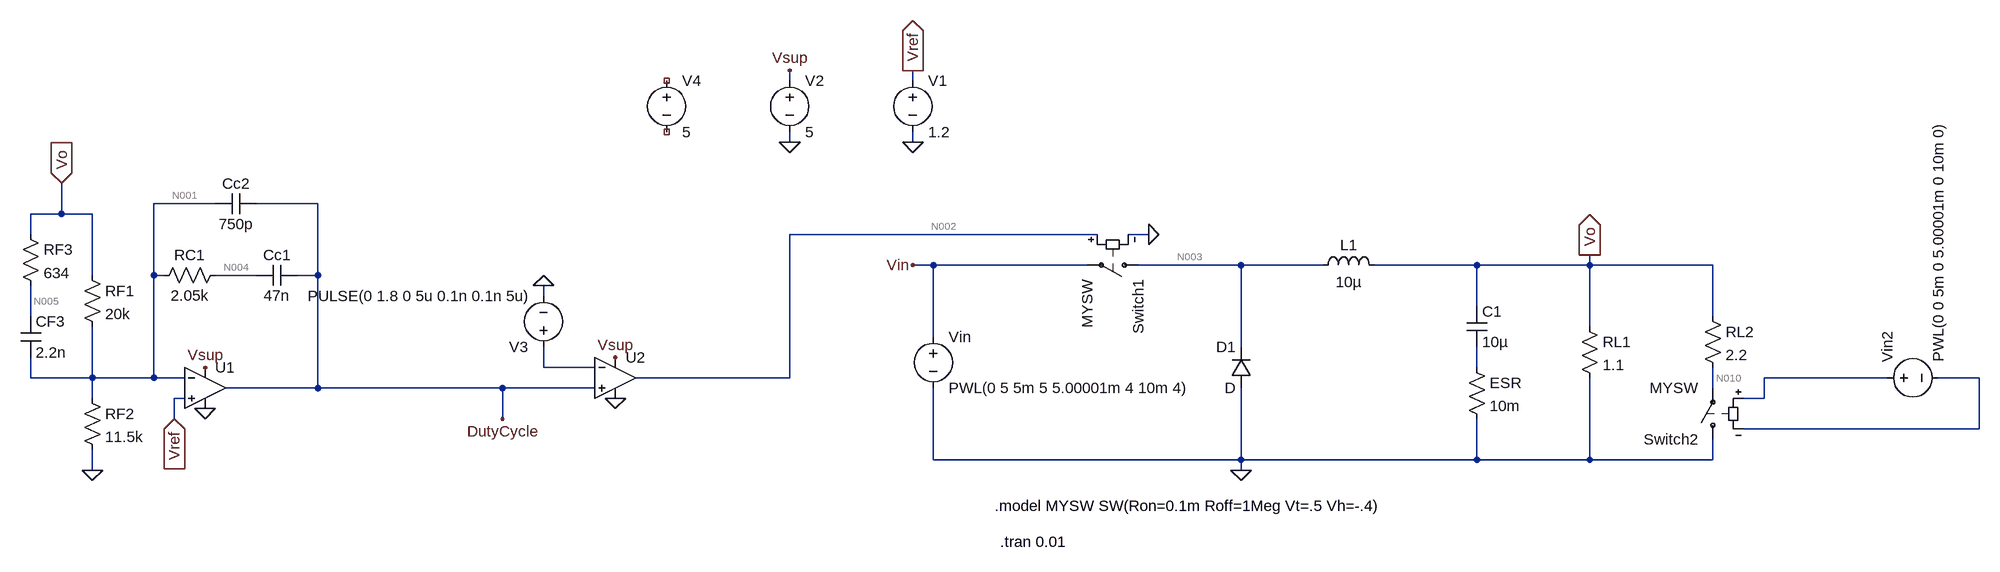
[diagram p0: schematic Buck_Controller_Modeling_20kHz.asc]
Buck_Controller_Modeling_20kHz.asc, the LTspice schematic file:
Version 4
SHEET 1 1812 680
WIRE -48 -272 -48 -288
WIRE 144 -272 144 -288
WIRE -48 -176 -48 -192
WIRE 144 -176 144 -192
WIRE -944 -80 -1040 -80
WIRE -784 -80 -880 -80
WIRE -1184 -64 -1184 -112
WIRE -1184 -64 -1232 -64
WIRE -1136 -64 -1184 -64
WIRE -1232 -32 -1232 -64
WIRE 432 -32 -48 -32
WIRE 512 -32 480 -32
WIRE 176 16 144 16
WIRE 416 16 176 16
WIRE 656 16 496 16
WIRE 784 16 656 16
WIRE 1024 16 864 16
WIRE 1200 16 1200 0
WIRE 1200 16 1024 16
WIRE 1392 16 1200 16
WIRE -1136 32 -1136 -64
WIRE -1040 32 -1040 -80
WIRE -1024 32 -1040 32
WIRE -880 32 -944 32
WIRE -784 32 -784 -80
WIRE -784 32 -816 32
WIRE -432 64 -432 48
WIRE 1024 80 1024 16
WIRE -1232 96 -1232 48
WIRE 1392 96 1392 16
WIRE 1200 112 1200 16
WIRE 176 128 176 16
WIRE 656 144 656 16
WIRE -432 176 -432 144
WIRE -352 176 -432 176
WIRE 1024 176 1024 144
WIRE -1232 192 -1232 160
WIRE -1136 192 -1136 112
WIRE -1136 192 -1232 192
WIRE -1040 192 -1040 32
WIRE -1040 192 -1136 192
WIRE -992 192 -1040 192
WIRE -48 192 -48 -32
WIRE -48 192 -288 192
WIRE 1664 192 1472 192
WIRE 1808 192 1744 192
WIRE -784 208 -784 32
WIRE -784 208 -928 208
WIRE -496 208 -784 208
WIRE -352 208 -496 208
WIRE 1392 208 1392 176
WIRE -1136 224 -1136 192
WIRE -992 224 -1008 224
WIRE 1472 224 1472 192
WIRE 1472 224 1440 224
WIRE -1008 256 -1008 224
WIRE -496 256 -496 208
WIRE 1808 272 1808 192
WIRE 1808 272 1440 272
WIRE 176 320 176 208
WIRE 656 320 656 208
WIRE 656 320 176 320
WIRE 1024 320 1024 256
WIRE 1024 320 656 320
WIRE 1200 320 1200 192
WIRE 1200 320 1024 320
WIRE 1392 320 1392 288
WIRE 1392 320 1200 320
WIRE -1136 336 -1136 304
WIRE 656 336 656 320
FLAG 656 336 0
FLAG 1200 0 Vo
IOPIN 1200 0 Out
FLAG 144 -176 0
FLAG 144 -288 Vref
IOPIN 144 -288 Out
FLAG -1136 336 0
FLAG -1008 256 Vref
IOPIN -1008 256 In
FLAG -48 -176 0
FLAG -48 -288 Vsup
FLAG -960 176 Vsup
FLAG -960 240 0
FLAG -432 48 0
FLAG -320 160 Vsup
FLAG -320 224 0
FLAG 512 -32 0
FLAG -1184 -112 Vo
IOPIN -1184 -112 In
FLAG -496 256 DutyCycle
FLAG 144 16 Vin
SYMBOL voltage 176 112 R0
WINDOW 123 0 0 Left 0
WINDOW 39 0 0 Left 0
SYMATTR InstName Vin
SYMATTR Value PWL(0 5 5m 5 5.00001m 4 10m 4)
SYMBOL sw 512 16 R90
SYMATTR InstName Switch1
SYMATTR Value MYSW
SYMBOL diode 672 208 R180
WINDOW 0 24 64 Left 2
WINDOW 3 24 0 Left 2
SYMATTR InstName D1
SYMBOL ind 768 32 R270
WINDOW 0 32 56 VTop 2
WINDOW 3 5 56 VBottom 2
SYMATTR InstName L1
SYMATTR Value 10µ
SYMBOL cap 1008 80 R0
SYMATTR InstName C1
SYMATTR Value 10µ
SYMBOL res 1008 160 R0
SYMATTR InstName ESR
SYMATTR Value 10m
SYMBOL res 1184 96 R0
SYMATTR InstName RL1
SYMATTR Value 1.1
SYMBOL Opamps\\UniversalOpamp2 -960 208 R0
SYMATTR InstName U1
SYMBOL voltage 144 -288 R0
SYMATTR InstName V1
SYMATTR Value 1.2
SYMBOL res -1248 -48 R0
SYMATTR InstName RF3
SYMATTR Value 634
SYMBOL res -1152 16 R0
SYMATTR InstName RF1
SYMATTR Value 20k
SYMBOL cap -1248 96 R0
SYMATTR InstName CF3
SYMATTR Value 2.2n
SYMBOL res -1152 208 R0
SYMATTR InstName RF2
SYMATTR Value 11.5k
SYMBOL res -928 16 R90
WINDOW 0 0 56 VBottom 2
WINDOW 3 32 56 VTop 2
SYMATTR InstName RC1
SYMATTR Value 2.05k
SYMBOL cap -816 16 R90
WINDOW 0 0 32 VBottom 2
WINDOW 3 32 32 VTop 2
SYMATTR InstName Cc1
SYMATTR Value 47n
SYMBOL cap -880 -96 R90
WINDOW 0 0 32 VBottom 2
WINDOW 3 32 32 VTop 2
SYMATTR InstName Cc2
SYMATTR Value 750p
SYMBOL voltage -48 -288 R0
WINDOW 123 0 0 Left 0
WINDOW 39 0 0 Left 0
SYMATTR InstName V2
SYMATTR Value 5
SYMBOL Opamps\\UniversalOpamp2 -320 192 R0
SYMATTR InstName U2
SYMBOL voltage -432 160 R180
WINDOW 123 0 0 Left 0
WINDOW 39 0 0 Left 0
SYMATTR InstName V3
SYMATTR Value PULSE(0 1.8 0 5u 0.1n 0.1n 5u)
SYMBOL sw 1392 304 R180
SYMATTR InstName Switch2
SYMATTR Value MYSW
SYMBOL res 1376 80 R0
SYMATTR InstName RL2
SYMATTR Value 2.2
SYMBOL voltage 1648 192 R270
WINDOW 123 0 0 Left 0
WINDOW 39 0 0 Left 0
SYMATTR InstName Vin2
SYMATTR Value PWL(0 0 5m 0 5.00001m 0 10m 0)
SYMBOL voltage -240 -288 R0
WINDOW 123 0 0 Left 0
WINDOW 39 0 0 Left 0
SYMATTR InstName V4
SYMATTR Value 5
TEXT 280 448 Left 2 !.tran 0.01
TEXT 272 392 Left 2 !.model MYSW SW(Ron=0.1m Roff=1Meg Vt=.5 Vh=-.4)

The netlist it stands for:
* Buck_Controller_Modeling_20kHz.asc
Vin Vin 0 PWL(0 5 5m 5 5.00001m 4 10m 4)
Switch1 N003 Vin N002 0 MYSW
D1 0 N003 D
L1 N003 Vo 10µ
C1 Vo N007 10µ
R§ESR N007 0 10m
RL1 Vo 0 1.1
XU1 Vref N001 Vsup 0 DutyCycle level.2 Avol=1Meg GBW=10Meg Slew=10Meg ilimit=25m rail=0 Vos=0 phimargin=45 en=0 enk=0 in=0 ink=0 Rin=500Meg  ; pins IN+ IN- V+ V- OUT
V1 Vref 0 1.2
RF3 Vo N005 634
RF1 Vo N001 20k
CF3 N005 N001 2.2n
RF2 N001 0 11.5k
RC1 N004 N001 2.05k
Cc1 DutyCycle N004 47n
Cc2 DutyCycle N001 750p
V2 Vsup 0 5
XU2 DutyCycle N006 Vsup 0 N002 level.2 Avol=1Meg GBW=10Meg Slew=10Meg ilimit=25m rail=0 Vos=0 phimargin=45 en=0 enk=0 in=0 ink=0 Rin=500Meg  ; pins IN+ IN- V+ V- OUT
V3 N006 0 PULSE(0 1.8 0 5u 0.1n 0.1n 5u)
Switch2 0 N010 N008 N009 MYSW
RL2 Vo N010 2.2
Vin2 N008 N009 PWL(0 0 5m 0 5.00001m 0 10m 0)
V4 NC_01 NC_02 5
.model D D
.lib standard.dio
.tran 0.01
.model MYSW SW(Ron=0.1m Roff=1Meg Vt=.5 Vh=-.4)
.lib UniversalOpamps2.sub
.backanno
.end

* Results of the author's LTspice run, read from the files saved beside the schematic
* Operating Point, zero values left out:
*   V(vin) = 5 V
*   V(n003) = 5 V
*   V(n002) = 4.944 V
*   V(vo) = 4.995 V
*   V(dutycycle) = 6.017 µV
*   V(vsup) = 5 V
*   V(n001) = 1.824 V
*   V(vref) = 1.2 V
*   V(n005) = 4.995 V
*   V(n004) = 1.824 V
*   V(n010) = 4.995 V
*   I(D1) = -5.01 pA
*   I(L1) = 4.541 A
*   I(Rl2) = 4.995 µA
*   I(Rf2) = 158.6 µA
*   I(Rf1) = 158.6 µA
*   I(Rl1) = 4.541 A
*   I(Switch2) = 4.995 µA
*   I(Switch1) = 4.541 A
*   I(V3) = 5 nA
*   I(V2) = -53.14 µA
*   I(V1) = 2.6 nA
*   I(Vin) = -4.541 A
*   Ix(u1:1) = -2.6 nA
*   Ix(u1:2) = -1.353 nA
*   Ix(u1:3) = 603 nA
*   Ix(u1:4) = -529.1 nA
*   Ix(u1:5) = 5 nA
*   Ix(u2:1) = -5 nA
*   Ix(u2:2) = -5 nA
*   Ix(u2:3) = 52.54 µA
*   Ix(u2:4) = -52.55 µA